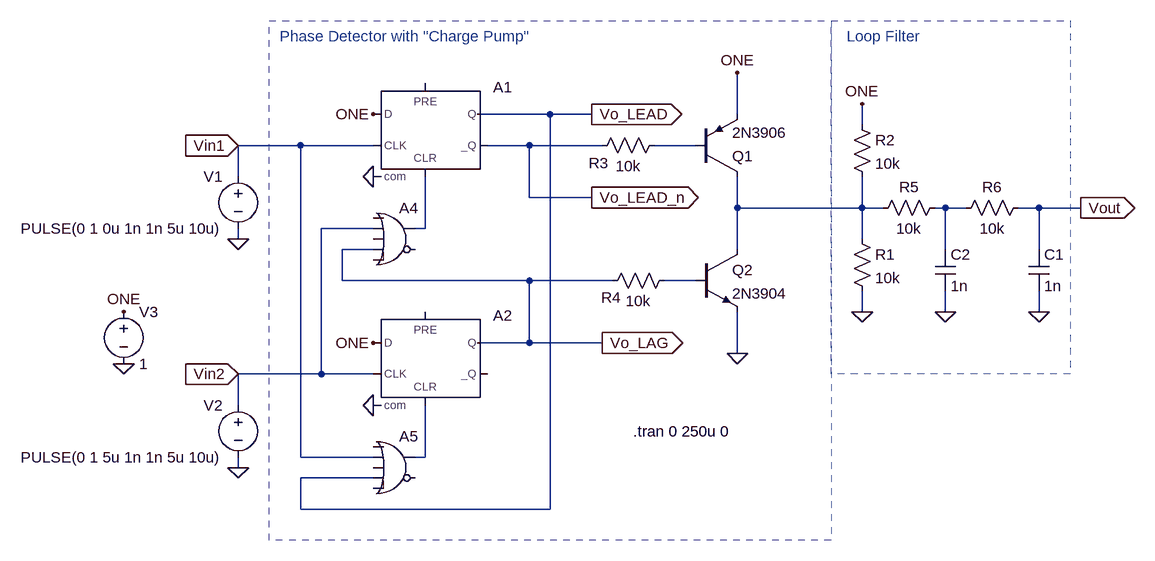
[diagram p0: schematic Type2 Phase Detector.asc]
Type2 Phase Detector.asc, the LTspice schematic file:
Version 4
SHEET 1 2016 1028
WIRE 352 96 240 96
WIRE 416 96 352 96
WIRE 640 96 640 32
WIRE 832 112 832 80
WIRE -32 144 -128 144
WIRE 80 144 -32 144
WIRE 320 144 256 144
WIRE 432 144 320 144
WIRE 576 144 512 144
WIRE -128 192 -128 144
WIRE 320 224 320 144
WIRE 416 224 320 224
WIRE 640 240 640 192
WIRE 832 240 832 192
WIRE 832 240 640 240
WIRE 864 240 832 240
WIRE 960 240 944 240
WIRE 992 240 960 240
WIRE 1104 240 1072 240
WIRE 1168 240 1104 240
WIRE 80 272 0 272
WIRE 160 272 160 192
WIRE 160 272 144 272
WIRE -128 288 -128 272
WIRE 832 288 832 240
WIRE 80 304 32 304
WIRE 640 304 640 240
WIRE 960 304 960 240
WIRE 1104 304 1104 240
WIRE 32 352 32 304
WIRE 320 352 32 352
WIRE 448 352 320 352
WIRE 576 352 528 352
WIRE 832 400 832 368
WIRE 960 400 960 368
WIRE 1104 400 1104 368
WIRE 320 448 320 352
WIRE 320 448 240 448
WIRE 432 448 320 448
WIRE 640 464 640 400
WIRE 0 496 0 272
WIRE 0 496 -128 496
WIRE 80 496 0 496
WIRE -128 544 -128 496
WIRE -32 624 -32 144
WIRE 80 624 -32 624
WIRE 160 624 160 544
WIRE 160 624 144 624
WIRE -128 640 -128 624
WIRE 80 656 -32 656
WIRE -32 704 -32 656
WIRE 352 704 352 96
WIRE 352 704 -32 704
FLAG -128 288 0
FLAG -128 640 0
FLAG 80 192 0
FLAG 80 544 0
FLAG 416 96 Vo_LEAD
IOPIN 416 96 Out
FLAG 432 448 Vo_LAG
IOPIN 432 448 Out
FLAG -304 480 0
FLAG -304 400 ONE
FLAG 80 96 ONE
FLAG 80 448 ONE
FLAG 640 32 ONE
FLAG 640 464 0
FLAG 1168 240 Vout
IOPIN 1168 240 Out
FLAG 416 224 Vo_LEAD_n
IOPIN 416 224 Out
FLAG 832 400 0
FLAG 960 400 0
FLAG 832 80 ONE
FLAG 1104 400 0
FLAG -128 144 Vin1
IOPIN -128 144 In
FLAG -128 496 Vin2
IOPIN -128 496 In
SYMBOL Digital\\dflop 160 48 R0
SYMATTR InstName A1
SYMBOL Digital\\dflop 160 400 R0
SYMATTR InstName A2
SYMBOL voltage -128 176 M0
WINDOW 123 0 0 Left 0
WINDOW 39 0 0 Left 0
SYMATTR InstName V1
SYMATTR Value PULSE(0 1 0u 1n 1n 5u 10u)
SYMBOL voltage -128 528 M0
WINDOW 123 0 0 Left 0
WINDOW 39 0 0 Left 0
SYMATTR InstName V2
SYMATTR Value PULSE(0 1 5u 1n 1n 5u 10u)
SYMBOL voltage -304 384 R0
WINDOW 123 0 0 Left 0
WINDOW 39 0 0 Left 0
SYMATTR InstName V3
SYMATTR Value 1
SYMBOL Digital\\or 112 224 R0
SYMATTR InstName A4
SYMBOL Digital\\or 112 576 R0
SYMATTR InstName A5
SYMBOL res 816 272 R0
SYMATTR InstName R1
SYMATTR Value 10k
SYMBOL pnp 576 192 M180
SYMATTR InstName Q1
SYMATTR Value 2N3906
SYMBOL npn 576 304 R0
SYMATTR InstName Q2
SYMATTR Value 2N3904
SYMBOL res 528 128 R90
WINDOW 0 59 101 VBottom 2
WINDOW 3 32 56 VTop 2
SYMATTR InstName R3
SYMATTR Value 10k
SYMBOL res 544 336 R90
WINDOW 0 58 98 VBottom 2
WINDOW 3 32 56 VTop 2
SYMATTR InstName R4
SYMATTR Value 10k
SYMBOL cap 944 304 R0
SYMATTR InstName C2
SYMATTR Value 1n
SYMBOL res 816 96 R0
SYMATTR InstName R2
SYMATTR Value 10k
SYMBOL res 960 224 R90
WINDOW 0 0 56 VBottom 2
WINDOW 3 32 56 VTop 2
SYMATTR InstName R5
SYMATTR Value 10k
SYMBOL cap 1088 304 R0
SYMATTR InstName C1
SYMATTR Value 1n
SYMBOL res 1088 224 R90
WINDOW 0 0 56 VBottom 2
WINDOW 3 32 56 VTop 2
SYMATTR InstName R6
SYMATTR Value 10k
TEXT 480 584 Left 2 !.tran 0 250u 0
TEXT -64 -24 Left 2 ;Phase Detector with "Charge Pump"
TEXT 808 -24 Left 2 ;Loop Filter
RECTANGLE Normal 784 752 -80 -48 2
RECTANGLE Normal 1152 496 784 -48 2

The netlist it stands for:
* Type2 Phase Detector.asc
A1 ONE 0 Vin1 0 N004 Vo_LEAD_n Vo_LEAD 0 DFLOP
A2 ONE 0 Vin2 0 N006 0 Vo_LAG 0 DFLOP
V1 Vin1 0 PULSE(0 1 0u 1n 1n 5u 10u)
V2 Vin2 0 PULSE(0 1 5u 1n 1n 5u 10u)
V3 ONE 0 1
A4 0 Vin2 0 Vo_LAG 0 0 N004 0 OR
A5 0 Vin1 0 Vo_LEAD 0 0 N006 0 OR
R1 N002 0 10k
Q1 N002 N001 ONE 0 2N3906
Q2 N002 N005 0 0 2N3904
R3 N001 Vo_LEAD_n 10k
R4 N005 Vo_LAG 10k
C2 N003 0 1n
R2 ONE N002 10k
R5 N003 N002 10k
C1 Vout 0 1n
R6 Vout N003 10k
.model NPN NPN
.model PNP PNP
.lib standard.bjt
.tran 0 250u 0
* Phase Detector with "Charge Pump"
* Loop Filter
.backanno
.end